# Altium schematic sheet 5VCircuit.SchDoc
size A4
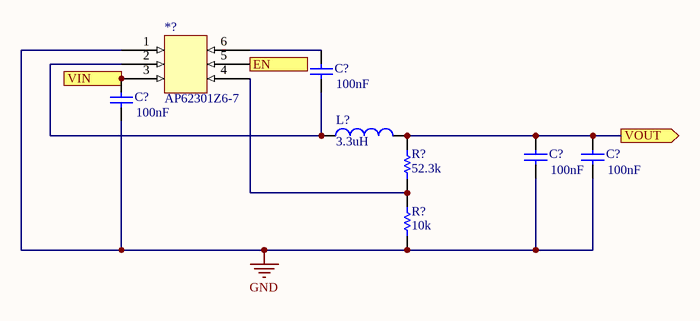
[diagram p0: 5VCircuit.SchDoc]

## Parts
(Parts that share a designator on the sheet are numbered #1, #2 ... from top to bottom, then left to right.)
*?  AP62301Z6-7
C?#1  value 100nF  [C0805]  (hidden comment: Cap)
C?#2  value 100nF  [C0805]  (hidden comment: Cap)
C?#3  value 100nF  [C0805]  (hidden comment: Cap)
C?#4  value 100nF  [C0805]  (hidden comment: Cap)
L?  value 3.3uH  [0402-A]  (hidden comment: Inductor)
R?#1  value 52.3k  [0603]  (hidden comment: Res1)
R?#2  value 10k  [0603]  (hidden comment: Res1)

## Ports
EN (in), VIN (in), VOUT (out)

## Nets
GND: *?.1 C?#2.1 C?#3.1 C?#4.1 R?#2.2
EN: *?.5 ; port EN
VIN: *?.3 C?#2.2 ; port VIN
VOUT: C?#3.2 C?#4.2 L?.2 R?#1.1 ; port VOUT
Net*?_2: *?.2 C?#1.1 L?.1
Net*?_4: *?.4 R?#1.2 R?#2.1
Net*?_6: *?.6 C?#1.2

## Library data of the parts
*? = AP62301Z6-7: Switching Voltage Regulators DCDC Conv HV Buck SOT563 T&R 3K
C?#1-C?#4 = Cap: Capacitor; Published: 8-Jun-2000; LatestRevisionDate: 17-Jul-2002; LatestRevisionNote: Re-released for DXP Platform.; PackageReference: RAD-0.3; Publisher: Altium Limited; PackageDescription: Radial Cap, Thru-Hole; 2 Leads; 0.3 in Pin Spacing
L? = Inductor: Code_IEC: 1005; Published: 8-Jun-2000; LatestRevisionDate: 29-May-2009; LatestRevisionNote: IPC-7351 Footprint Added.; PackageReference: 0402-A; Publisher: Altium Limited; PackageDescription: Chip Inductor; Code_JEITA: 0402
R?#1 R?#2 = Res1: Resistor; Published: 8-Jun-2000; LatestRevisionDate: 17-Jul-2002; LatestRevisionNote: Re-released for DXP Platform.; PackageReference: AXIAL-0.3; Publisher: Altium Limited; PackageDescription: Axial Device, Thru-Hole; 2 Leads; 0.3 in Pin Spacing